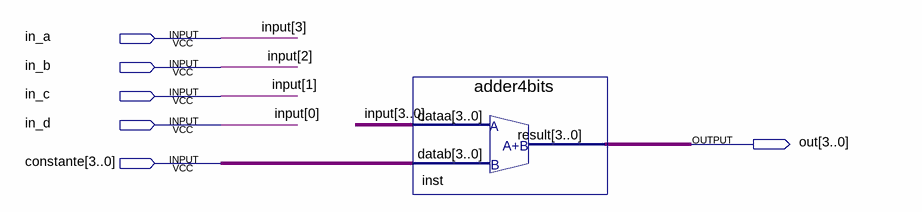
[diagram p0: schematic sheet]
// Quartus schematic sumador_constant.bdf as structural Verilog: 1 symbols, 6 pins
module sumador_constant (
  input  in_a,
  input  in_b,
  input  in_c,
  input  in_d,
  input  [3:0] constante,
  output [3:0] out
);

  adder4bits inst (.dataa({in_a, in_b, in_c, in_d}), .datab(constante), .result(out));

  // Other names for the same wires on the sheet: input[3:0] = {in_a, in_b, in_c, in_d}
endmodule
